# EAGLE design atmega328p_standalone (EAGLE 7.2.0)
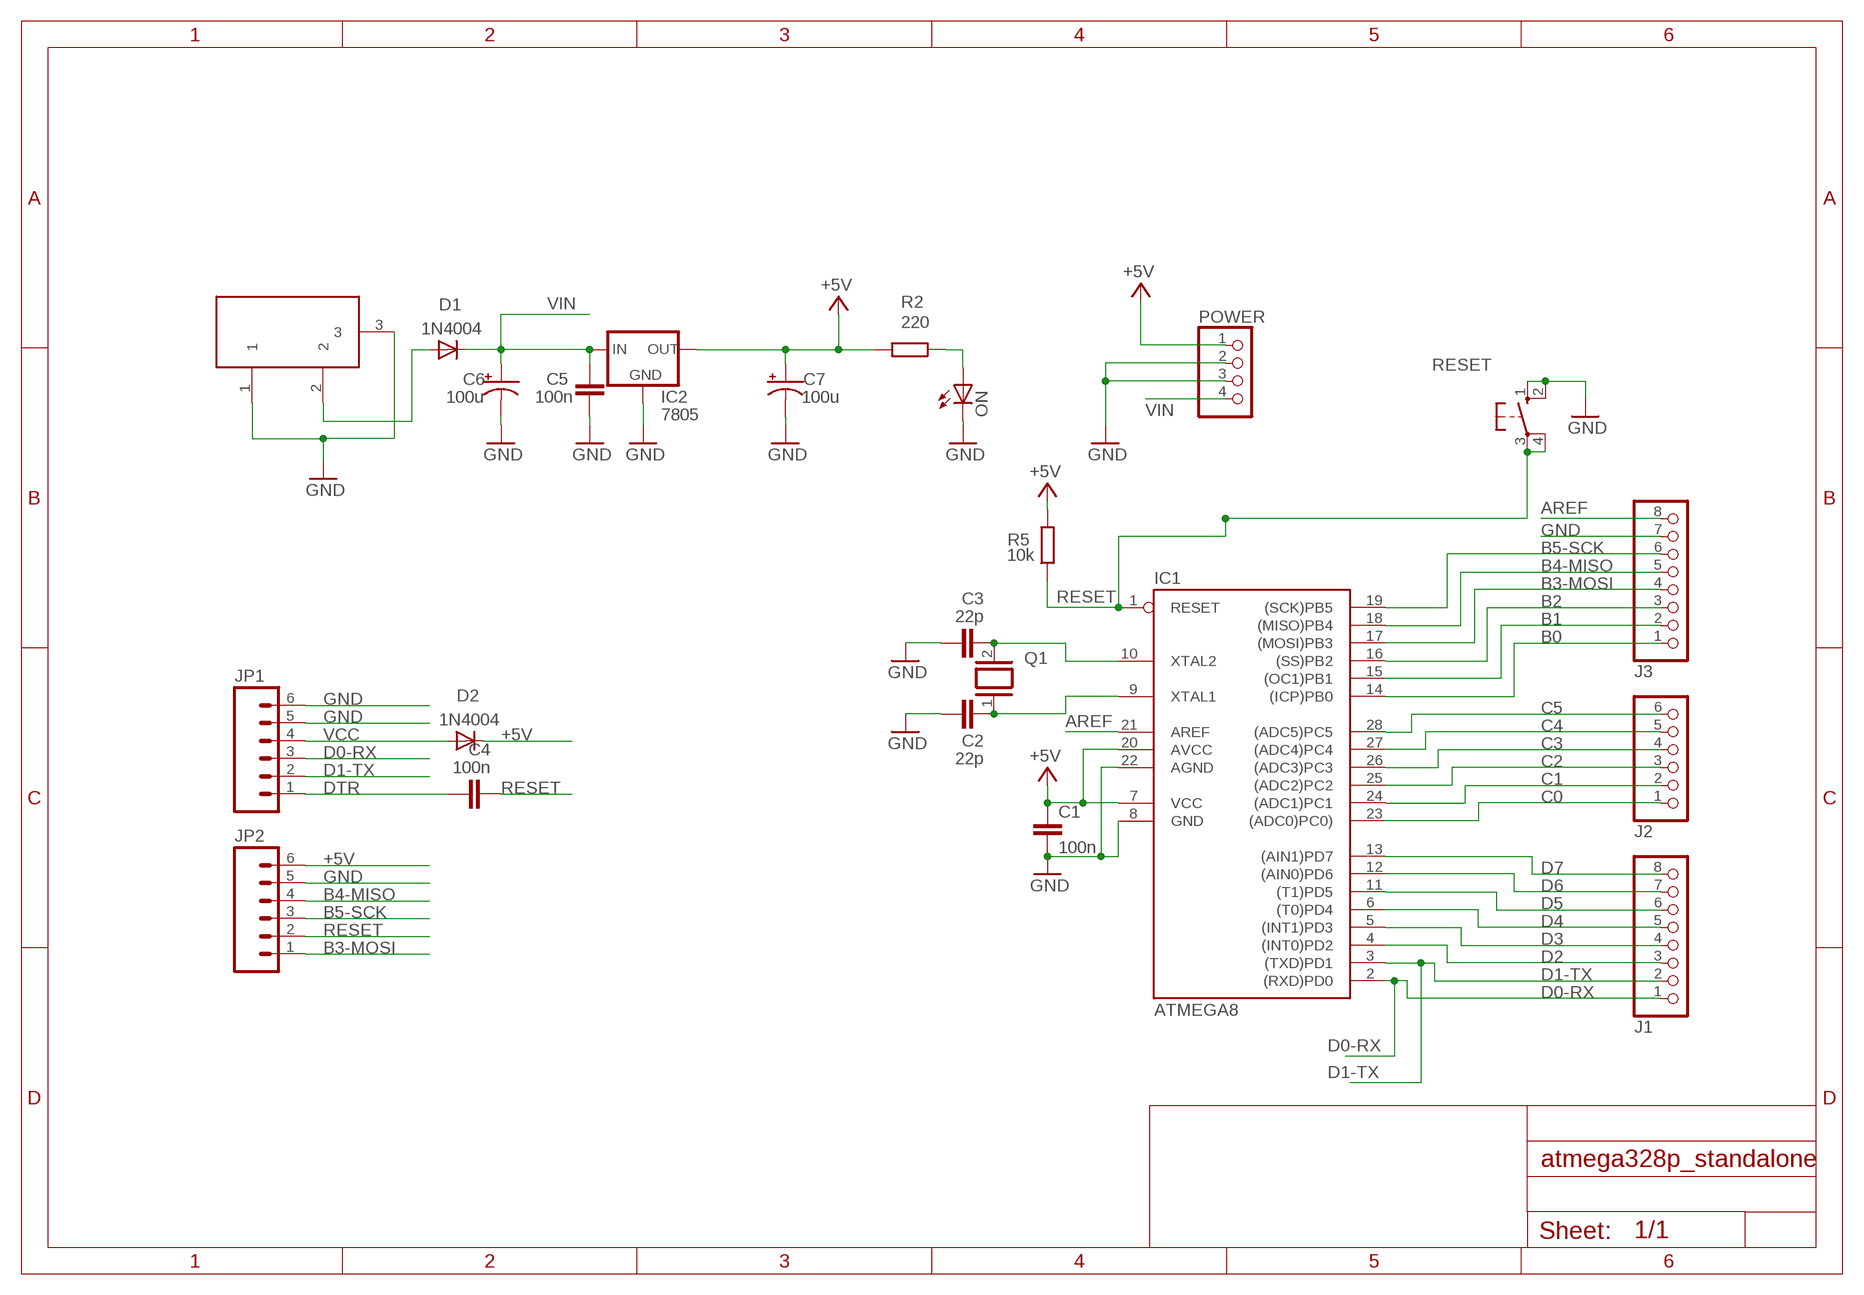
[diagram p0: schematic, sheet 1]

## Parts
C1  100n  C-EU025-024X044  [C025-024X044]
C2  22p  C-EU025-024X044  [C025-024X044]
C3  22p  C-EU025-024X044  [C025-024X044]
C4  100n  C-EU025-024X044  [C025-024X044]
C5  100n  C-EU025-024X044  [C025-024X044]
C6  100u  CPOL-USE2.5-7  [E2,5-7]
C7  100u  CPOL-USE2.5-7  [E2,5-7]
D1  1N4004  [DO41-10]
D2  1N4004  [DO41-10]
DC1  DC21MMX  [DC-21MM]
IC1  ATMEGA8  AT90S4433P  [DIL28-3]
IC2  7805  78MXXS  [78MXXS]
J1  PINHD-1X8  [1X08]
J2  PINHD-1X6  [1X06]
J3  PINHD-1X8  [1X08]
JP1  M06SIP  [1X06]
JP2  M06SIP  [1X06]
ON  LED3MM  [LED3MM]
POWER  PINHD-1X4  [1X04]
Q1  XTAL/S  [QS]
R2  220  R-EU_0207/10  [0207/10]
R5  10k  R-EU_0207/10  [0207/10]
RESET  10-XX  [B3F-10XX]

## Nets
+5V [power]: C1.1 C7.+ D2.C IC1.7(VCC) IC1.20(AVCC) IC2.OUT JP2.6 POWER.1 R2.2 R5.2
AREF: IC1.21(AREF) J3.8
B0: IC1.14((ICP)PB0) J3.1
B1: IC1.15((OC1)PB1) J3.2
B2: IC1.16((SS)PB2) J3.3
B3-MOSI: IC1.17((MOSI)PB3) J3.4 JP2.1
B4-MISO: IC1.18((MISO)PB4) J3.5 JP2.4
B5-SCK: IC1.19((SCK)PB5) J3.6 JP2.3
C0: IC1.23((ADC0)PC0)) J2.1
C1: IC1.24((ADC1)PC1) J2.2
C2: IC1.25((ADC2)PC2) J2.3
C3: IC1.26((ADC3)PC3) J2.4
C4: IC1.27((ADC4)PC4) J2.5
C5: IC1.28((ADC5)PC5) J2.6
D0-RX: IC1.2((RXD)PD0) J1.1 JP1.3
D1-TX: IC1.3((TXD)PD1) J1.2 JP1.2
D2: IC1.4((INT0)PD2) J1.3
D3: IC1.5((INT1)PD3) J1.4
D4: IC1.6((T0)PD4) J1.5
D5: IC1.11((T1)PD5) J1.6
D6: IC1.12((AIN0)PD6) J1.7
D7: IC1.13((AIN1)PD7) J1.8
DTR: C4.1 JP1.1
GND [power]: C1.2 C2.1 C3.1 C5.1 C6.- C7.- DC1.1 DC1.3 IC1.8(GND) IC1.22(AGND) IC2.GND J3.7 JP1.5 JP1.6 JP2.5 ON.K(C) POWER.2 POWER.3 RESET.1(S) RESET.2(S1)
N$3: ON.A R2.1
N$6: C2.2 IC1.9(XTAL1) Q1.1
N$7: C3.2 IC1.10(XTAL2) Q1.2
N$8: D1.A DC1.2
RESET: C4.2 IC1.1(RESET) JP2.2 R5.1 RESET.3(P) RESET.4(P1)
VCC: D2.A JP1.4
VIN [power]: C5.2 C6.+ D1.C IC2.IN POWER.4

## Library data of the parts
C1-C5 = resistor:C-EU: CAPACITOR, European symbol
C6 C7 = adafruit:CPOL-US: POLARIZED CAPACITOR, American symbol
D1 D2 = diode:1N4004: DIODE general purpose rectifier, 1 A
DC1 = powersupply:DC21MM
IC1 = atmel:AT90S4433: MICROCONTROLLER 4 Kbytes FLASH 128 bytes SRAM 256 bytes EEPROM UART 6-channel 10 bit ADC
IC2 = v-reg:78MXXS: VOLTAGE REGULATOR
J1 J3 = pinhead:PINHD-1X8: PIN HEADER
J2 = pinhead:PINHD-1X6: PIN HEADER
JP1 JP2 = SparkFun(1):M06: Header 6 Standard 6-pin 0.1" header. Use with straight break away headers (SKU : PRT-00116), right angle break away headers (PRT-00553), swiss pins (PRT-00743), machine pins (PRT-00117), and female headers (PRT-00115). Molex polarized connector foot print use with SKU : PRT-08094 with associated crimp pins and housings. NOTES ON THE VARIANTS LOCK and LOCK_LONGPADS... This footprint was designed to help hold the alignment of a through-hole component (i.e. 6-pin header) while soldering it into place. You may notice that each hole has been shifted either up or down by 0.005 of an inch from it's more standard position (which is a perfectly straight line). This slight alteration caused the pins (the squares in the middle) to touch the edges of the holes. Because they are alternating, it causes a "brace" to hold the component in place. 0.005 has proven to be the perfect amount of "off-center" position when using our standard breakaway headers. Although looks a little odd when you look at the bare footprint, once you have a header in there, the alteration is very hard to notice. Also, if you push a header all the way into place, it is covered up entirely on the bottom side. This idea of altering the position of holes to aid alignment will be further integrated into the Sparkfun Library for other footprints. It can help hold any component with 3 or more connection pins.
ON = led:LED: LED OSRAM: - CHIPLED LG R971, LG N971, LY N971, LG Q971, LY Q971, LO R971, LY R971 LH N974, LH R974 LS Q976, LO Q976, LY Q976 LO Q996 - Hyper CHIPLED LW Q18S LB Q993, LB Q99A, LB R99A - SideLED LS A670, LO A670, LY A670, LG A670, LP A670 LB A673, LV A673, LT A673, LW A673 LH A674 LY A675 LS A676, LA A676, LO A676, LY A676, LW A676 LS A679, LY A679, LG A679 - Hyper Micro SIDELED® LS Y876, LA Y876, LO Y876, LY Y876 LT Y87S - SmartLED LW L88C, LW L88S LB L89C, LB L89S, LG L890 LS L89K, LO L89K, LY L89K LS L896, LA L896, LO L896, LY L896 - TOPLED LS T670, LO T670, LY T670, LG T670, LP T670 LSG T670, LSP T670, LSY T670, LOP T670, LYG T670 LG T671, LOG T671, LSG T671 LB T673, LV T673, LT T673, LW T673 LH T674 LS T676, LA T676, LO T676, LY T676, LB T676, LH T676, LSB T676, LW T676 LB T67C, LV T67C, LT T67C, LS T67K, LO T67K, LY T67K, LW E67C LS E67B, LA E67B, LO E67B, LY E67B, LB E67C, LV E67C, LT E67C LW T67C LS T679, LY T679, LG T679 LS T770, LO T770, LY T770, LG T770, LP T770 LB T773, LV T773, LT T773, LW T773 LH T774 LS E675, LA E675, LY E675, LS T675 LS T776, LA T776, LO T776, LY T776, LB T776 LHGB T686 LT T68C, LB T68C - Hyper Mini TOPLED® LB M676 - Mini TOPLED Santana® LG M470 LS M47K, LO M47K, LY M47K Source: http://www.osram.convergy.de/
POWER = pinhead:PINHD-1X4: PIN HEADER
Q1 = special:XTAL/S: CRYSTAL
R2 R5 = rcl:R-EU_: RESISTOR, European symbol
RESET = switch-omron:10-XX: OMRON SWITCH

## Net classes
1 power: width 0.61 mm

## Board
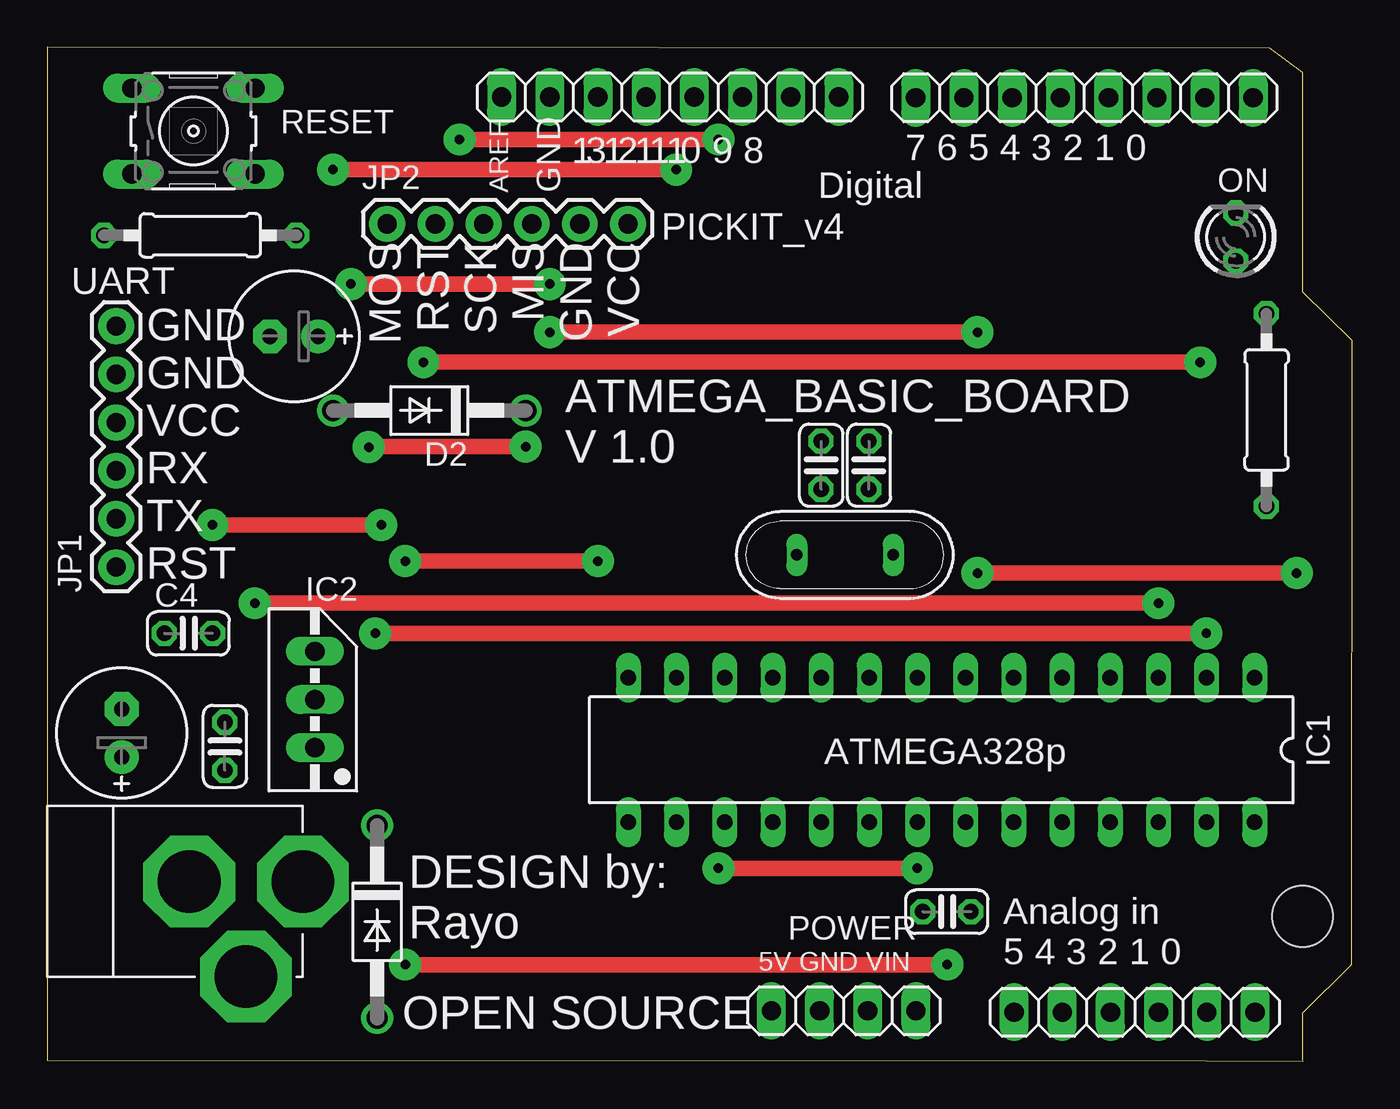
[diagram p1: board, top side]
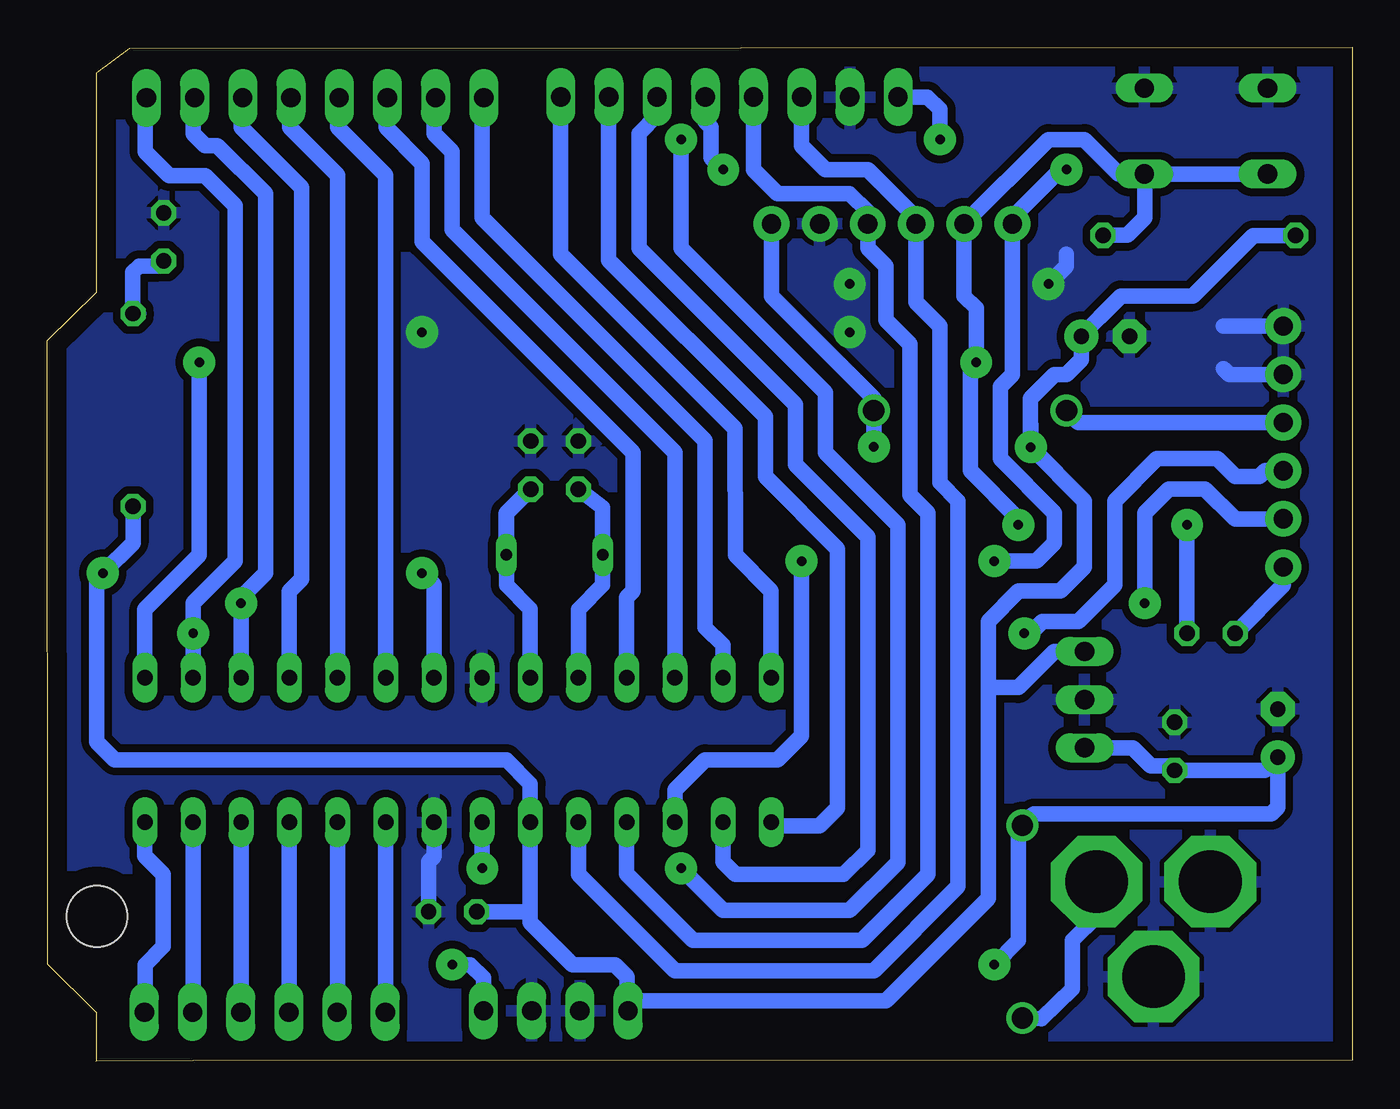
[diagram p2: board, bottom side, seen from below]

Size 68.77 x 53.44 mm. Coordinates in mm from the lower left corner, seen from the top.
Outline: 0,53.44 0,0.05 61.09,0.01 66.19,0 66.19,0.05 66.17,2.55 68.75,5.11 68.77,38 66.17,40.54 66.17,52.1 64.44,53.4 0,53.44
Copper layers (1*16): Top 0.035mm / dielectric 1.5mm / Bottom 0.035mm
Design rules "default": minimum track width 10mil, minimum drill 24mil, track to track 8mil, track to pad 8mil, pad to pad 8mil, via to via 8mil, smd to smd 8mil, copper to edge 40mil, drill to drill 8mil, minimum pad ring 10mil, minimum via ring 8mil, stop-mask expansion 4mil, vias tented up to drill 0mil, thermal gap 10mil
Holes 3.2 mm at 66.17,7.63

### Footprints (pad centres in the part's own frame; a part is rotated, then mirrored left to right if it is on the bottom)
C025-024X044 = drill 0.813 octagon: 1 -1.27,0; 2 1.27,0
E2,5-7 = drill 0.813 pad 1.778: + -1.27,0 | drill 0.813 pad 1.778 octagon: - 1.27,0
DO41-10 = drill 1.118: A 5.08,0; C -5.08,0
DC-21MM = drill 3.302 pad 4.826 octagon: 1 -5.08,-3.353; 2 -0.076,-6.35; 3 -0.076,-0.356
DIL28-3 = drill 0.813 long: 1 -16.51,-3.81; 2 -13.97,-3.81; 3 -11.43,-3.81; 4 -8.89,-3.81; 5 -6.35,-3.81; 6 -3.81,-3.81; 7 -1.27,-3.81; 8 1.27,-3.81; 9 3.81,-3.81; 10 6.35,-3.81; 11 8.89,-3.81; 12 11.43,-3.81; 13 13.97,-3.81; 14 16.51,-3.81; 15 16.51,3.81; 16 13.97,3.81; 17 11.43,3.81; 18 8.89,3.81; 19 6.35,3.81; 20 3.81,3.81; 21 1.27,3.81; 22 -1.27,3.81; 23 -3.81,3.81; 24 -6.35,3.81; 25 -8.89,3.81; 26 -11.43,3.81; 27 -13.97,3.81; 28 -16.51,3.81
78MXXS = drill 1.016 long: GND 0,-2.54; IN -2.54,-2.54; OUT 2.54,-2.54
1X08 = drill 1.016 long: 1 -8.89,0; 2 -6.35,0; 3 -3.81,0; 4 -1.27,0; 5 1.27,0; 6 3.81,0; 7 6.35,0; 8 8.89,0
1X06 = drill 1.016 long: 1 -6.35,0; 2 -3.81,0; 3 -1.27,0; 4 1.27,0; 5 3.81,0; 6 6.35,0
1X06' = drill 1.016 pad 1.88: 1 0,0; 2 2.54,0; 3 5.08,0; 4 7.62,0; 5 10.16,0; 6 12.7,0
LED3MM = drill 0.813 octagon: A -1.27,0; K 1.27,0
1X04 = drill 1.016 long: 1 -3.81,0; 2 -1.27,0; 3 1.27,0; 4 3.81,0
QS = drill 0.61 long: 1 -2.54,0; 2 2.54,0
0207/10 = drill 0.813 octagon: 1 -5.08,0; 2 5.08,0
B3F-10XX = drill 1.016 long: 1 -3.251,2.261; 2 3.251,2.261; 3 -3.251,-2.261; 4 3.251,-2.261

### Placement (x,y rotation side)
C1  47.41,7.87 0 top
C2  43.3,31.42 270 top
C3  40.78,31.42 270 top
C4  7.43,22.55 0 top
C5  9.35,16.6 270 top
C6  3.92,17.3 90 top
C7  13,38.21 180 top
D1  17.38,7.35 270 top
D2  20.13,34.3 180 top
DC1  7.12,9.54 90 top
IC1  47.13,16.4 180 top
IC2  11.56,19.06 90 top
J1  54.67,50.79 180 top
J2  57.31,2.58 0 top
J3  32.83,50.83 180 top
JP1  [1X06']  3.62,26.05 90 top
JP2  [1X06']  17.91,44.14 0 top
ON  62.65,43.45 90 top
POWER  41.97,2.65 0 top
Q1  42.04,26.69 180 top
R2  64.26,34.33 270 top
R5  8.05,43.53 180 top
RESET  7.7,49.03 0 top

### Tracks (layer width: path | path; a pad name or v marks a point on that pad's centre or on a via)
+5V  (via drill 0.5 pad 1.68)
  Top 0.813: v65.85,25.73 v49.03,25.73 | v25.21,32.4 16.96,32.4 v16.93,32.37
  Bottom 0.813: v49.03,25.73 48.39,25.09 IC1.7 | POWER.1 38.23,2.72 38.23,3.19 | 38.23,3.19 38.23,4.46 38.87,5.09 41.09,5.09 43.32,7.32 43.32,7.95 | 43.32,7.95 IC1.20 43.32,14.63 44.58,15.89 65.22,15.89 66.17,16.84 66.17,25.41 v65.85,25.73 64.26,27.32 R2.2 | IC2.OUT 15.69,21.6 17.59,19.7 19.18,19.7 | 19.18,19.7 19.18,23.19 17.59,24.78 15.37,24.78 14.1,26.05 14.1,29.54 v16.93,32.37 | R5.2 3,43.51 5.21,43.51 8.39,40.33 12.2,40.33 13.32,39.21 C7.+ 14.27,36.99 15.05,36.21 15.69,36.21 16.96,34.94 v16.93,32.37 | C1.1 43.4,7.87 43.32,7.95 | 19.18,19.7 19.18,8.58 24.58,3.19 38.23,3.19 | JP2.6 30.61,40.33 25.21,34.94 v25.21,32.4 D2.C | v16.93,32.37 16.96,32.4 16.96,34.25 v16.93,32.37
AREF  (via drill 0.5 pad 1.68)
  Top 0.813: v21.72,48.59 v35.37,48.59 | v35.37,10.17 v45.85,10.17
  Bottom 0.813: J3.8 22.37,50.83 21.72,50.18 v21.72,48.59 | v35.37,48.59 35.37,42.87 27.75,35.25 27.75,32.08 23.94,28.27 23.94,10.49 26.48,7.95 33.15,7.95 v35.37,10.17 | v45.85,10.17 IC1.21
B0
  Bottom 0.813: IC1.14 30.62,24.79 32.52,26.68 32.53,33.36 41.72,42.55 J3.1
B1
  Bottom 0.813: IC1.15 30.62,12.4 30.61,12.39 28.07,12.39 27.12,13.35 27.12,27 30.93,30.81 30.93,33.98 39.18,42.24 J3.2
B2
  Bottom 0.813: IC1.16 33.16,10.5 32.52,9.85 26.8,9.85 25.53,11.12 25.53,27.63 29.34,31.44 29.34,34.62 37.6,42.87 37.6,48.91 36.64,49.86 J3.3
B3-MOSI  (via drill 0.5 pad 1.68)
  Top 0.813: v29.02,26.36 v18.86,26.36 | v15.05,47 v33.15,47
  Bottom 0.813: IC1.17 35.69,14.3 34.1,15.89 30.29,15.89 29.02,17.16 v29.02,26.36 | v18.86,26.36 16.64,26.36 15.69,27.32 15.69,28.9 18.54,31.76 18.54,35.57 17.91,36.21 JP2.1 17.91,44.46 15.37,47 v15.05,47 | v33.15,47 33.79,47.64 33.79,49.22 34.1,49.54 J3.4
B4-MISO
  Bottom 0.813: IC1.18 38.24,9.86 34.74,6.36 25.85,6.36 22.36,9.85 22.36,28.9 23.31,29.86 23.31,37.79 24.58,39.06 24.58,41.92 25.53,42.87 JP2.4 25.53,44.78 26.48,45.73 30.29,45.73 31.55,46.99 J3.5
B5-SCK
  Bottom 0.813: IC1.19 40.77,9.85 35.69,4.77 25.21,4.77 20.77,9.22 20.77,29.54 21.72,30.49 21.72,38.75 22.99,40.02 JP2.3 22.99,44.46 25.53,47 27.75,47 29.02,48.26 J3.6
C0
  Bottom 0.813: IC1.23 50.94,2.6 J2.1
C1
  Bottom 0.813: IC1.24 53.48,2.6 J2.2
C2
  Bottom 0.813: IC1.25 56.02,2.6 J2.3
C3
  Bottom 0.813: IC1.26 58.56,2.6 J2.4
C4
  Bottom 0.813: IC1.27 61.1,2.6 J2.5
C5
  Bottom 0.813: IC1.28 63.64,10.82 62.68,9.85 62.68,6.04 63.63,5.09 63.63,2.61 J2.6
D0-RX  (via drill 0.5 pad 1.68)
  Top 0.813: v17.27,22.55 v61.09,22.55
  Bottom 0.813: IC1.2 61.1,24.13 v61.09,22.55 61.09,24.14 58.87,26.36 58.87,45.1 60.46,46.68 62.36,46.68 63.63,47.95 63.63,50.71 J1.1 | JP1.3 4.58,31.13 4.89,30.81 6.16,30.81 7.12,31.76 10.29,31.76 12.51,29.54 12.51,25.09 14.42,23.19 16.32,23.19 16.96,22.55 v17.27,22.55
D1-TX  (via drill 0.5 pad 1.68)
  Top 0.813: v10.93,24.14 v58.56,24.14
  Bottom 0.813: IC1.3 v58.56,24.14 58.56,24.45 57.28,25.73 57.28,45.73 59.82,48.27 60.46,48.27 61.09,48.91 61.09,50.71 J1.2 | JP1.2 6.16,28.59 7.75,30.17 9.66,30.17 10.93,28.9 v10.93,24.14
D2
  Bottom 0.813: IC1.4 56.02,24.76 55.38,25.41 55.38,46.05 58.55,49.22 58.55,50.71 J1.3
D3
  Bottom 0.813: IC1.5 53.48,46.69 56.01,49.22 56.01,50.71 J1.4
D4
  Bottom 0.813: IC1.6 50.94,46.69 53.47,49.22 53.47,50.71 J1.5
D5
  Bottom 0.813: IC1.11 38.24,24.45 37.91,24.78 37.91,32.08 49.03,43.19 49.03,47.32 50.93,49.22 50.93,50.71 J1.6
D6
  Bottom 0.813: IC1.12 35.7,32.09 47.44,43.83 47.44,47.95 48.39,48.91 48.39,50.71 J1.7
D7
  Bottom 0.813: IC1.13 33.16,21.93 34.1,22.87 34.1,32.71 45.85,44.46 45.85,50.71 J1.8
DTR
  Bottom 0.813: JP1.1 3.62,25.09 C4.1
GND  (via drill 0.5 pad 1.68)
  Top 0.813: v26.48,40.97 v16,40.97 | v49.03,38.43 v26.48,38.43
  Bottom 0.813: JP1.6 6.8,38.75 | JP1.5 6.48,36.21 6.8,36.52 | C1.2 48.68,10.52 48.39,10.81 IC1.22 | v16,40.97 15.05,41.92 15.05,42.56 | v26.48,38.43 26.48,38.75
  pour Bottom (isolate 0.406): 0.13,53.35 64.58,53.35 66.22,52.03 66.2,40.6 68.71,38.09 68.71,2.55 66.17,0.01 0.13,0.01
N$3
  Bottom 0.813: R2.1 63.97,39.41 64.27,39.7 64.27,41.6 63.95,41.92 62.9,41.92 ON.A
N$6
  Bottom 0.813: IC1.9 43.32,23.83 44.58,25.09 44.58,28.91 Q1.1 44.58,28.87 C2.2
N$7
  Bottom 0.813: IC1.10 40.78,23.81 39.5,25.09 39.5,28.91 Q1.2 39.5,29.19 C3.2
N$8
  Bottom 0.813: D1.A 16.39,2.23 14.74,3.82 14.74,6.36 13.47,7.63 DC1.2
RESET  (via drill 0.5 pad 1.68)
  Top 0.813: v60.77,36.84 v19.81,36.84 | v8.7,28.27 v17.59,28.27
  Bottom 0.813: RESET.3 RESET.4 | RESET.4 10.93,46.74 10.93,44.46 11.85,43.53 R5.1 | IC1.1 63.64,23.81 60.77,26.68 v60.77,36.84 | C4.2 v8.7,28.27 | v17.59,28.27 17.59,28.59 20.13,31.13 20.13,36.52 v19.81,36.84 19.81,39.7 20.45,40.33 JP2.2 16,48.59 14.1,48.59 12.28,46.77 RESET.4
VCC
  Bottom 0.813: JP1.4 14.42,33.67 D2.A
VIN  (via drill 0.5 pad 1.68)
  Top 0.813: v47.44,5.09 v18.86,5.09
  Bottom 0.813: POWER.4 45.79,4.39 46.48,5.09 v47.44,5.09 | v18.86,5.09 17.59,6.36 17.59,12.22 D1.C 16.78,13.03 4.26,13.03 3.92,13.37 C6.+ 4.61,15.33 C5.2 9.59,15.57 10.61,15.57 11.56,16.52 IC2.IN

### Text on the board
tPlace: MOS / RST / SCK / MIS / GND / VCC | GND / GND / VCC / RX / TX / RST
tNames: 1 1 1 1 | 3 2 1 0 9 8 | 7 6 5 4 3 2 1 0 | AREF | GND | Digital | PICKIT_v4 | UART | ATMEGA_BASIC_BOARD / V 1.0 | ATMEGA328p | Analog in | DESIGN by: / Rayo | 5V GND VIN | 5 4 3 2 1 0 | OPEN SOURCE